# Altium project adapter_board.PrjPcb
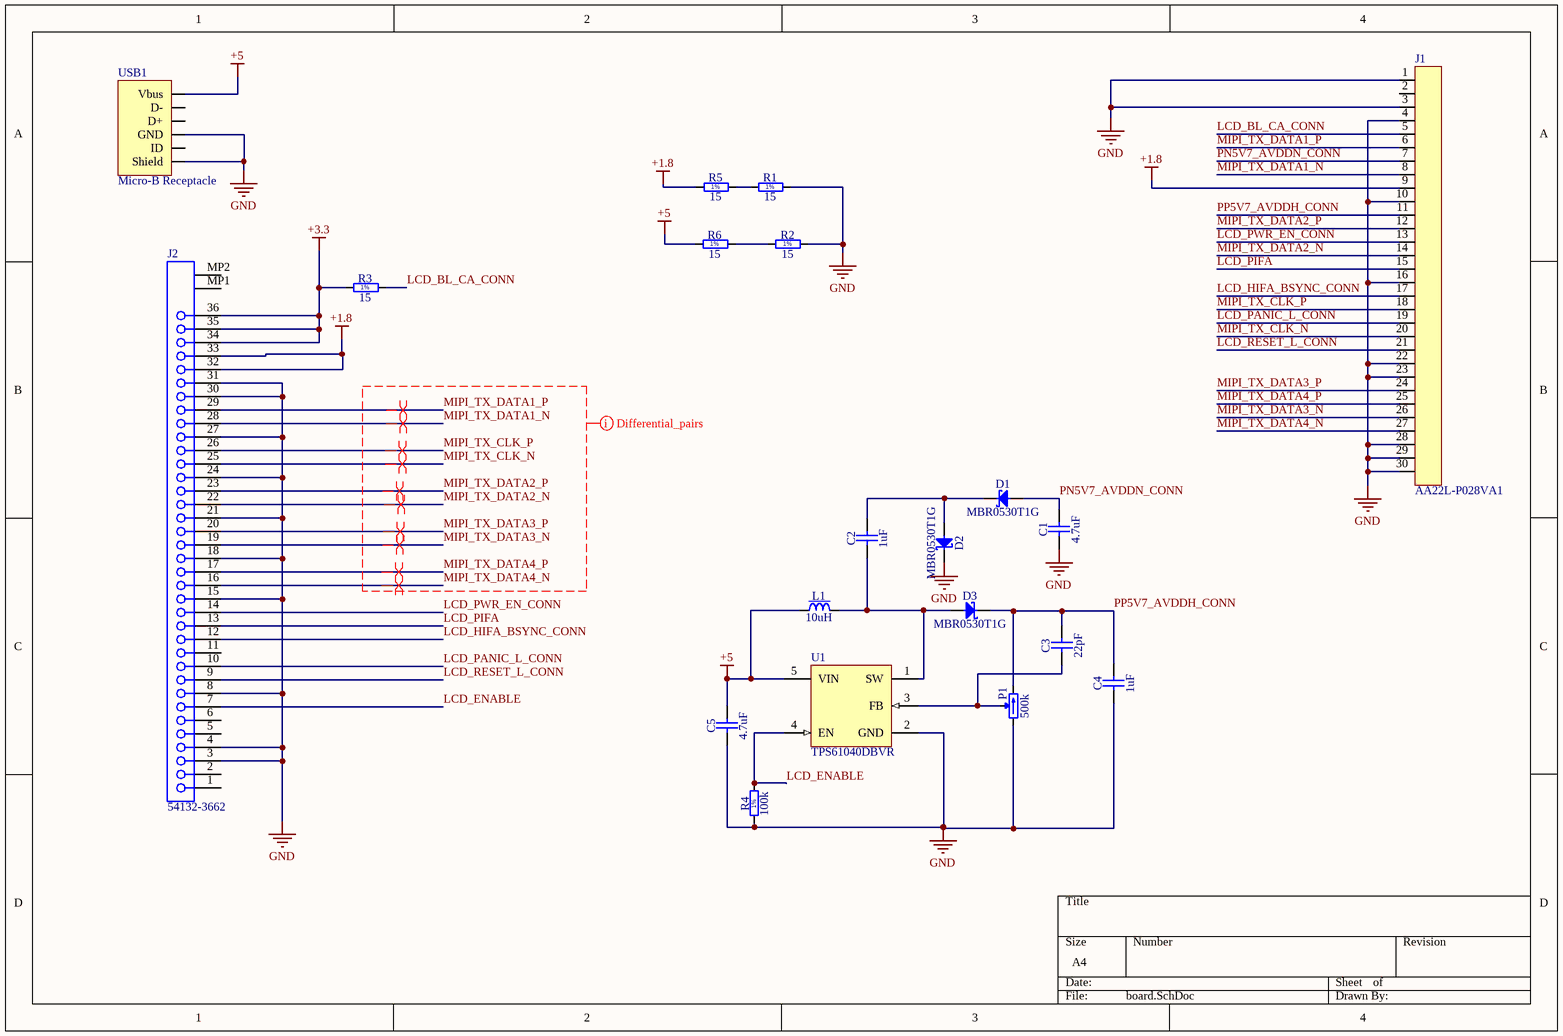
[diagram p0: board.SchDoc]
1 sheet, 20 parts. Net scope: global (net labels, ports and power ports of the same name join across sheets).
Board file: adapter.PcbDoc

## Sheet board.SchDoc
size A4

### Parts
C1  4.7uF  [CAPC2013X145N]
C2  1uF  [CAPC2013X145N]
C3  22pF  [CAPC2013X145N]
C4  1uF  [CAPC2013X145N]
C5  4.7uF  [CAPC2013X145N]
D1  MBR0530T1G  [SOD3715X145N]
D2  MBR0530T1G  [SOD3715X145N]
D3  MBR0530T1G  [SOD3715X145N]
J1  AA22L-P028VA1  [AA22L-P028VA1]
J2  54132-3662  [MOLX-54132-3662]
L1  10uH  [INDC2012X145N]
P1  500k  [TRIM_VISHAY_T63YB]
R1  15  [RESC1608X55N]
R2  15  [RESC1608X55N]
R3  15  [RESC1608X55N]
R4  100k  [RESC1608X55N]
R5  15  [RESC1608X55N]
R6  15  [RESC1608X55N]
U1  TPS61040DBVR  [TI-DBV5_L]
USB1  Micro-B Receptacle  [47346-0001]

### Nets
+1.8: J1.9 J2.32 J2.33 R5.1
+3.3: J2.34 J2.35 J2.36 R3.1
+5: C5.2 L1.1 R6.1 U1.5(VIN) USB1.1(Vbus)
GND: C1.1 C4.1 C5.1 D2.1(C) J1.1 J1.3 J1.4 J1.10 J1.16 J1.22 J1.23 J1.28 J1.29 J1.30 J2.3 J2.4 J2.8 J2.15 J2.18 J2.21 J2.24 J2.27 J2.30 J2.31 P1.1(CCW) R1.2 R2.2 R4.1 U1.2(GND) USB1.0(Shield) USB1.5(GND)
LCD_BL_CA_CONN: J1.5 R3.2
LCD_ENABLE: J2.7 R4.2 U1.4(EN)
LCD_HIFA_BSYNC_CONN: J1.17 J2.12
LCD_PANIC_L_CONN: J1.19 J2.10
LCD_PIFA: J1.15 J2.13
LCD_PWR_EN_CONN: J1.13 J2.14
LCD_RESET_L_CONN: J1.21 J2.9
MIPI_TX_CLK_N: J1.20 J2.25
MIPI_TX_CLK_P: J1.18 J2.26
MIPI_TX_DATA1_N: J1.8 J2.28
MIPI_TX_DATA1_P: J1.6 J2.29
MIPI_TX_DATA2_N: J1.14 J2.22
MIPI_TX_DATA2_P: J1.12 J2.23
MIPI_TX_DATA3_N: J1.26 J2.19
MIPI_TX_DATA3_P: J1.24 J2.20
MIPI_TX_DATA4_N: J1.27 J2.16
MIPI_TX_DATA4_P: J1.25 J2.17
PN5V7_AVDDN_CONN: C1.2 D1.2(A) J1.7
PP5V7_AVDDH_CONN: C3.2 C4.2 D3.1(C) J1.11 P1.3(CW)
NetC2_1: C2.1 D3.2(A) L1.2 U1.1(SW)
NetC2_2: C2.2 D1.1(C) D2.2(A)
NetC3_1: C3.1 P1.2(W) U1.3(FB)
NetR1_1: R1.1 R5.2
NetR2_1: R2.1 R6.2

Not connected (* = marked no-connect by the designer): J1 2; J2 1 2 5 6 11 MP1 MP2; USB1 2(D-) 3(D+) 4(ID)

### Layout directives
differential pair: MIPI_TX_CLK_N, MIPI_TX_CLK_P, MIPI_TX_DATA1_N, MIPI_TX_DATA1_P, MIPI_TX_DATA2_N, MIPI_TX_DATA2_P, MIPI_TX_DATA3_N, MIPI_TX_DATA3_P, MIPI_TX_DATA4_N, MIPI_TX_DATA4_P
mark named Differential_pairs: MIPI_TX_CLK_N, MIPI_TX_CLK_P, MIPI_TX_DATA1_N, MIPI_TX_DATA1_P, MIPI_TX_DATA2_N, MIPI_TX_DATA2_P, MIPI_TX_DATA3_N, MIPI_TX_DATA3_P, MIPI_TX_DATA4_N, MIPI_TX_DATA4_P

### Notes on the sheet
- (in symbol R0603_15R_1%_0.1W_100PPM) 1%

### Library data of the parts
C1-C5 = CC0805_10NF_500V_10%_X7R_YAGEO_MID-VOLTAGE: Non-polarised capacitor; Part Description: SMD Multilayer Chip Ceramic Capacitor; Manufacturer: YAGEO; Manufacturer Part Number: 222297015636 or CC0805KKX7RBBB103; Value: 10nF; Voltage: 500V; TC: X7R; Tolerance: ±10%; Part Number: CC0805_10NF_500V_10%_X7R_YAGEO_MID-VOLTAGE; Component Kind: Standard; Component Type: Standard; Pin Count: 2; Status: Preferred; Case: 0805; Mounted: Yes; Socket: No; SMD: Yes; Sense: No; ComponentHeight: 1.45mm; HelpURL: \\cern.ch\dfs\Applications\Altium\Datasheets\CC0805_NP0X7R_MID-VOLTAGE_100-to-630V.pdf; Author: CERN DEM JLC; CreateDate: 18.06.2013; LatestRevisionDate: 22.02.2016
D1-D3 = MBR0530T1G: Schottky Diode; Part Description: Schottky Power Rectifier; Manufacturer: ON SEMICONDUCTOR; Voltage: 30V; Power: 500mA; PressFit: No; Bonding: No; Part Number: MBR0530T1G; Component Kind: Standard; Component Type: Standard; Device: MBR0530T1G; PackageDescription: SOD Diode (SOD-123); 2.70mm W X 1.55mm L X 1.45mm H body, IPC Medium Density; Manufacturer Part Number: MBR0530T1G; Pin Count: 2; Case: SOD-123; Mounted: Yes; Socket: No; SMD: Yes; Sense: No; ComponentHeight: 1.45mm; HelpURL: \\cern.ch\dfs\Applications\Altium\Datasheets\MBR0530T1G.pdf; Author: CERN DEM JLC; CreateDate: 21.07.2010; LatestRevisionDate: 21.07.2010
J2 = 54132-3662: 0.5 mm Pitch Easy-On(TM) Type FPC Connector, 2.0 mm Mated Height, Right Angle, ZIF, SMT, Bottom Contact, 36 Circuits, -20 to 85 degC, ELV and RoHS Compliant, Tape and Reel; Manufacturer: Molex; Circuits (Loaded): 36; Current (Max per Contact): 0.5A; Durability (mating cycles max): 20; Entry Angle: 90degrees Angle; Mated Height: 2.00mm; Material - Metal: Phosphor Bronze; Material - Plating Mating: Gold; PCB Locator: No; PCB Retention: Yes; Pitch - Mating Interface: 0.50mm; Voltage (Max): 50V; PackageVersion: Rev. F, 07/2010; PackageReference: 54132-3662; PackageDescription: 36-Lead FPC Connector, Pitch 0.5 mm; Supplier 1: Mouser; Supplier Part Number 1: 538-54132-3662; Contact Position: Bottom; Material - Plating Termination: Gold; Number of Rows: 1; Orientation: Right Angle; Packing: Tape and Reel; Polarized to PCB: Yes; RoHS: TRUE; Stackable: No; Mounting Technology: Surface Mount; PartNumber: 54132-3662; ComponentLink1Description: Manufacturer URL; ComponentLink1URL: http://www.molex.com/molex/index.jsp; ComponentLink2Description: Datasheet; ComponentLink2URL: http://www.molex.com/webdocs/datasheets/pdf/en-us/0541323662_FFC_FPC_CONNECTORS.pdf; ComponentLink3Description: Package Specification; ComponentLink3URL: http://www.molex.com/pdm_docs/sd/541323662_sd.pdf
L1 = IND0805_4.7UH_20%_TAIYO-YUDEN_CB: Inductor With Core; Part Description: Wound Chip Power Inductors (CB Series); Manufacturer: TAIYO YUDEN; Manufacturer Part Number: CB2012T4R7M; Value: 4.7uH; Power: 300mA; Resistance: 0.4R; Tolerance: ±20%; Part Number: IND0805_4.7UH_20%_TAIYO-YUDEN_CB; Component Kind: Standard; Component Type: Standard; Pin Count: 2; Status: None; Case: 0805; Mounted: Yes; Socket: No; SMD: Yes; Sense: No; ComponentHeight: 1.45mm; HelpURL: \\cern.ch\dfs\Applications\Altium\Datasheets\IND0805_TAIYO-YUDEN_CB.pdf; Author: CERN DEM JLC; CreateDate: 15.11.2010; LatestRevisionDate: 15.11.2010
P1 = TRIM_14T_50K_VISHAY_T63YB503KT20: Trimming Potentiometer; Part Description: 14 Turn Trimming Potentiometer  (Top Adjustement); Manufacturer: VISHAY SFERNICE; Value: 50k; Power: 0.25W; TC: ±100ppm/°C; Tolerance: ±10%; PressFit: No; Part Number: TRIM_14T_50K_VISHAY_T63YB503KT20; Component Kind: Standard; Component Type: Standard; Pin Count: 3; Manufacturer Part Number: T63YB503KT20; Case: T63YB; Mounted: Yes; Socket: No; SMD: No; Sense: No; ComponentHeight: 7.7mm; HelpURL: \\cern.ch\dfs\Applications\Altium\Datasheets\TRIM_VISHAY_T63YB.pdf; Author: CERN DEM JLC; CreateDate: 30.03.2011; LatestRevisionDate: 28.11.2012
R1-R3 R5 R6 = R0603_15R_1%_0.1W_100PPM: Resistor - 1%; Part Description: General Purpose Thick Film Chip Resistor; Manufacturer: GENERIC; Manufacturer1 Part Number: NRC06F15R0TRF; Power: 0.1W; TC: ±100ppm/°C; PressFit: No; Part Number: R0603_15R_1%_0.1W_100PPM; Component Kind: Standard; Component Type: Standard; Pin Count: 2; Value: 15; Status: Preferred; Tolerance: ±1%; Manufacturer Part Number: R0603_15R_1%_0.1W_100PPM; Case: 0603; Mounted: Yes; Sense: No; Socket: No; SMD: Yes; Manufacturer1 Example: NIC COMPONENT; Manufacturer1 ComponentHeight: 0.55mm; HelpURL: \\cern.ch\dfs\Applications\Altium\Datasheets\R0603_NIC_NRC.pdf; Author: CERN DEM JLC; CreateDate: 03.12.2007; LatestRevisionDate: 13.03.2008
R4 = R0603_15R_1%_0.1W_100PPM: Resistor - 1%; Part Description: General Purpose Thick Film Chip Resistor; Manufacturer: GENERIC; Manufacturer1 Part Number: NRC06F15R0TRF; Value: 15; Power: 0.1W; TC: ±100ppm/°C; PressFit: No; Part Number: R0603_15R_1%_0.1W_100PPM; Component Kind: Standard; Component Type: Standard; Pin Count: 2; Status: Preferred; Tolerance: ±1%; Manufacturer Part Number: R0603_15R_1%_0.1W_100PPM; Case: 0603; Mounted: Yes; Sense: No; Socket: No; SMD: Yes; Manufacturer1 Example: NIC COMPONENT; Manufacturer1 ComponentHeight: 0.55mm; HelpURL: \\cern.ch\dfs\Applications\Altium\Datasheets\R0603_NIC_NRC.pdf; Author: CERN DEM JLC; CreateDate: 03.12.2007; LatestRevisionDate: 13.03.2008
U1 = TPS61040DBVR: 28 V, 400 mA Switch Boost Converter for White LED Applications, 1.8 to 6 V, -40 to 85 degC, 5-pin SOT23 (DBV5), Green (RoHS & no Sb/Br); Manufacturer: Texas Instruments; Dimming: TRUE; Iout(Max)(A): 0.09; Iq(Typ)(mA): 0.028; Rating: Catalog; SubFamily: White LED Driver; Switching Frequency(Max)(kHz): 1000; Vin(Max)(V): 6; Vin(Min)(V): 1.8; DatasheetVersion: SLVS413F; PackageVersion: 4073253-4/K; PackageReference: DBV5; PackageDescription: 5-Pin Plastic Small Outline, Body 1.60 Г— 2.90 mm, Pitch 0.95 mm; Supplier 1: Digi-Key; Supplier Part Number 1: 296-12685-2-ND; Supplier 2: Digi-Key; Supplier Part Number 2: 296-12685-1-ND; Supplier 3: Digi-Key; Supplier Part Number 3: 296-12685-6-ND; Supplier 4: Farnell; Supplier Part Number 4: 1461061; Supplier 5: Farnell; Supplier Part Number 5: 1461061RL; Supplier 6: Newark; Supplier Part Number 6: 35K1326; Supplier 7: Mouser; Supplier Part Number 7: 595-TPS61040DBVR; Eco-Plan: Green (RoHS & no Sb/Br); Topology: Boost; Mounting Technology: Surface Mount; Code_JEDEC: MO-178; PartNumber: TPS61040DBVR; ComponentLink1Description: Manufacturer URL; ComponentLink1URL: http://www.ti.com/; ComponentLink2Description: Datasheet; ComponentLink2URL: http://www.ti.com/general/docs/lit/getliterature.tsp?genericPartNumber=TPS61040&fileType=pdf; ComponentLink3Description: Package Specification; ComponentLink3URL: http://www.ti.com/litv/pdf/mpds018i
USB1 = Micro-B Receptacle: 47346-0001